# Altium schematic sheet MCU.SchDoc
size A4
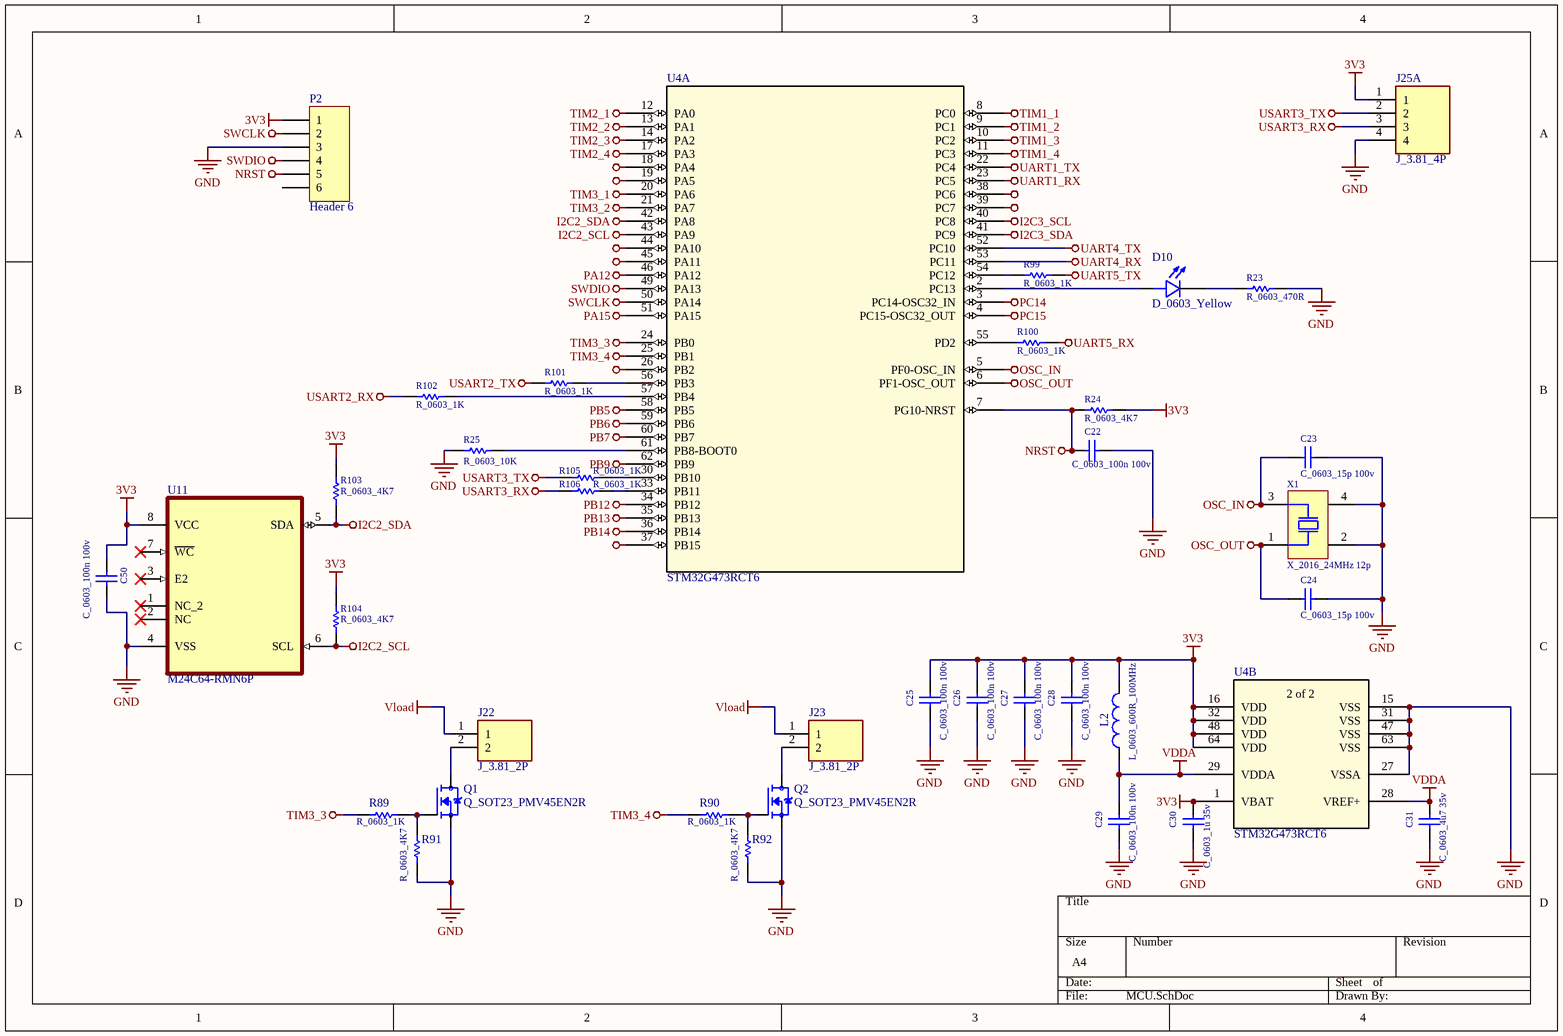
[diagram p0: MCU.SchDoc]

## Parts
C22  C_0603_100n 100v  [CAP 0603]
C23  C_0603_15p 100v  [CAP 0603]
C24  C_0603_15p 100v  [CAP 0603]
C25  C_0603_100n 100v  [CAP 0603]
C26  C_0603_100n 100v  [CAP 0603]
C27  C_0603_100n 100v  [CAP 0603]
C28  C_0603_100n 100v  [CAP 0603]
C29  C_0603_100n 100v  [CAP 0603]
C30  C_0603_1u 35v  [CAP 0603]
C31  C_0603_4u7 35v  [CAP 0603]
C50  C_0603_100n 100v  [CAP 0603]
D10  D_0603_Yellow  [Led 0603]
J22  J_3.81_2P  [2 Pin PCB TB 3.81]
J23  J_3.81_2P  [2 Pin PCB TB 3.81]
J25  J_3.81_4P  [4 Pin PCB TB 3.81]  (part A of 2)
L2  L_0603_600R_100MHz  [Inductor 0603]
P2  Header 6  [HDR1X6]
Q1  Q_SOT23_PMV45EN2R  [SOT23]
Q2  Q_SOT23_PMV45EN2R  [SOT23]
R23  R_0603_470R  [RES 0603]
R24  R_0603_4K7  [RES 0603]
R25  R_0603_10K  [RES 0603]
R89  R_0603_1K  [RES 0603]
R90  R_0603_1K  [RES 0603]
R91  R_0603_4K7  [RES 0603]
R92  R_0603_4K7  [RES 0603]
R99  R_0603_1K  [RES 0603]
R100  R_0603_1K  [RES 0603]
R101  R_0603_1K  [RES 0603]
R102  R_0603_1K  [RES 0603]
R103  R_0603_4K7  [RES 0603]
R104  R_0603_4K7  [RES 0603]
R105  R_0603_1K  [RES 0603]
R106  R_0603_1K  [RES 0603]
U4  STM32G473RCT6  [LQFP64]  (parts A,B of 2)
U11  M24C64-RMN6P  [SOIC8 - NO-EXP]
X1  X_2016_24MHz 12p  [Crystal 2016]

## Nets
3V3: C25.2 C26.2 C27.2 C28.2 C30.1 C50.1 J25.1 L2.2 P2.1 R24.1 R103.2 R104.2 U4.1(VBAT) U4.16(VDD) U4.32(VDD) U4.48(VDD) U4.64(VDD) U11.8(VCC)
GND: C22.1 C23.1 C24.1 C25.1 C26.1 C27.1 C28.1 C29.2 C30.2 C31.2 C50.2 J25.4 P2.3 Q1.2(S) Q2.2(S) R23.1 R25.1 R91.1 R92.1 U4.15(VSS) U4.27(VSSA) U4.31(VSS) U4.47(VSS) U4.63(VSS) U11.4(VSS) X1.2(NC) X1.4(NC)
I2C2_SCL: R104.1 U4.43(PA9) U11.6(SCL)
I2C2_SDA: R103.1 U4.42(PA8) U11.5(SDA)
I2C3_SCL: U4.40(PC8)
I2C3_SDA: U4.41(PC9)
NetU4_18: U4.18(PA4) U4.19(PA5) U4.26(PB2) U4.37(PB15) U4.38(PC6) U4.39(PC7) U4.44(PA10) U4.45(PA11)
NRST: C22.2 P2.5 R24.2 U4.7(PG10-NRST)
OSC_IN: C23.2 U4.5(PF0-OSC_IN) X1.3(OSC2)
OSC_OUT: C24.2 U4.6(PF1-OSC_OUT) X1.1(OSC1)
PA12: U4.46(PA12)
PA15: U4.51(PA15)
PB5: U4.58(PB5)
PB6: U4.59(PB6)
PB7: U4.60(PB7)
PB9: U4.62(PB9)
PB12: U4.34(PB12)
PB13: U4.35(PB13)
PB14: U4.36(PB14)
PC14: U4.3(PC14-OSC32_IN)
PC15: U4.4(PC15-OSC32_OUT)
SWCLK: P2.2 U4.50(PA14)
SWDIO: P2.4 U4.49(PA13)
TIM1_1: U4.8(PC0)
TIM1_2: U4.9(PC1)
TIM1_3: U4.10(PC2)
TIM1_4: U4.11(PC3)
TIM2_1: U4.12(PA0)
TIM2_2: U4.13(PA1)
TIM2_3: U4.14(PA2)
TIM2_4: U4.17(PA3)
TIM3_1: U4.20(PA6)
TIM3_2: U4.21(PA7)
TIM3_3: R89.2 U4.24(PB0)
TIM3_4: R90.2 U4.25(PB1)
UART1_RX: U4.23(PC5)
UART1_TX: U4.22(PC4)
UART4_RX: U4.53(PC11)
UART4_TX: U4.52(PC10)
UART5_RX: R100.1
UART5_TX: R99.1
USART2_RX: R102.2
USART2_TX: R101.2
USART3_RX: J25.3 R106.1
USART3_TX: J25.2 R105.1
VDDA: C29.1 C31.1 L2.1 U4.28(VREF+) U4.29(VDDA)
Vload: J22.1 J23.1
NetD10_1: D10.1(A) U4.2(PC13)
NetD10_2: D10.2(C) R23.2
NetJ22_2: J22.2 Q1.3(D)
NetJ23_2: J23.2 Q2.3(D)
NetQ1_1: Q1.1(G) R89.1 R91.2
NetQ2_1: Q2.1(G) R90.1 R92.2
NetR25_2: R25.2 U4.61(PB8-BOOT0)
NetR99_2: R99.2 U4.54(PC12)
NetR100_2: R100.2 U4.55(PD2)
NetR101_1: R101.1 U4.56(PB3)
NetR102_1: R102.1 U4.57(PB4)
NetR105_2: R105.2 U4.30(PB10)
NetR106_2: R106.2 U4.33(PB11)

Not connected (* = marked no-connect by the designer): P2 6; U11 1(NC_2)* 2(NC)* 3(E2)* 7(~{WC})*

## Notes on the sheet
- (in symbol STM32G473RCT6, part B) 2 of 2

## Library data of the parts
C22-C31 C50 = Cap: Capacitor; Published: 8-Jun-2000; LatestRevisionDate: 17-Jul-2002; LatestRevisionNote: Re-released for DXP Platform.; Publisher: Altium Limited
D10 = Led: MP: SML-D12FWT86; MF: Rohm; Price: None; Availability: In Stock; Package: 0603 Rohm; SnapEDA_Link: https://www.snapeda.com/parts/SML-D12FWT86/Rohm/view-part/?ref=snap; Check_prices: https://www.snapeda.com/parts/SML-D12FWT86/Rohm/view-part/?ref=eda; Value: *; Purchase-URL: https://pricing.snapeda.com/search/part/SML-D12FWT86/?ref=eda
J22 J23 = 2 Pin PCB Terminal Block: MF: CUI Devices; MP: TBP02R1-381-02BE; CUI_purchase_URL: https://www.cuidevices.com/product/interconnect/connectors/terminal-blocks/tbp02r1-381-series?utm_source=snapeda.com&utm_medium=referral&utm_campaign=snapedaBOM; Purchase-URL: https://pricing.snapeda.com/search/part/TBP02R1-381-02BE/?ref=eda; Price: None; SnapEDA_Link: https://www.snapeda.com/parts/TBP02R1-381-02BE/CUI+Devices/view-part/?ref=snap; Check_prices: https://www.snapeda.com/parts/TBP02R1-381-02BE/CUI+Devices/view-part/?ref=eda; Package: None; Availability: In Stock; Value: *
J25 = 4 Pin PCB Terminal Block: MP: TBP02R1-381-04BE; Availability: Unavailable; Package: None; Price: None; Value: *
L2 = Inductor: PCB_Layout: Complies with manufacturer's recommendation.; Published: 26-Sep-2008; DatasheetVersion: Mar-2008; PackageVersion: Mar-2008; PackageReference: B82462G4; Publisher: Altium Limited; PackageDescription: SM Power Inductor; 2 Leads; Body 6.3 x 6.3 x 3.0 mm (LxWxH); ComponentLink1Description: Manufacturer Link; ComponentLink1URL: http://www.epcos.com/; ComponentLink2Description: Datasheet; ComponentLink2URL: http://www.epcos.com/inf/30/db/ind_2008/b82462g4.pdf
P2 = Header 6: Header, 6-Pin; LatestRevisionDate: 17-Jul-2002; LatestRevisionNote: Re-released for DXP Platform.; Publisher: Altium Limited
Q1 Q2 = N Channel Mosfet: RoHS Compliant | Low RDS(on) | Industry-leading quality | Dynamic dv/dt Rating | Fast Switching | Fully Avalanche Rated | 175C Operating Temperature | Logic Level; MP: IRLR2705PBF; MF: Infineon Technologies; Check_prices: https://www.snapeda.com/parts/IRLR2705PBF/Infineon+Technologies/view-part/?ref=eda; Value: *; Availability: In Stock; Price: None; Package: TO-252 Infineon; SnapEDA_Link: https://www.snapeda.com/parts/IRLR2705PBF/Infineon+Technologies/view-part/?ref=snap; Purchase-URL: https://pricing.snapeda.com/search/part/IRLR2705PBF/?ref=eda
R23-R25 R89-R92 R99-R106 = Res: Resistor; Published: 8-Jun-2000; LatestRevisionDate: 17-Jul-2002; LatestRevisionNote: Re-released for DXP Platform.; Publisher: Altium Limited
U4 = STM32G473RCT6: No Description Available; Mfr_Name: STMicroelectronics; RefDes: RefDes; Type: Type
U11 = M24C64-RMN6P: EEPROM; Package: None; Price: None; Value: *; MP: M24C64-RMN6P; Availability: Unavailable
X1 = Crystal 4 Pin